# EAGLE schematic PCM5102a (EAGLE 6.5.0)
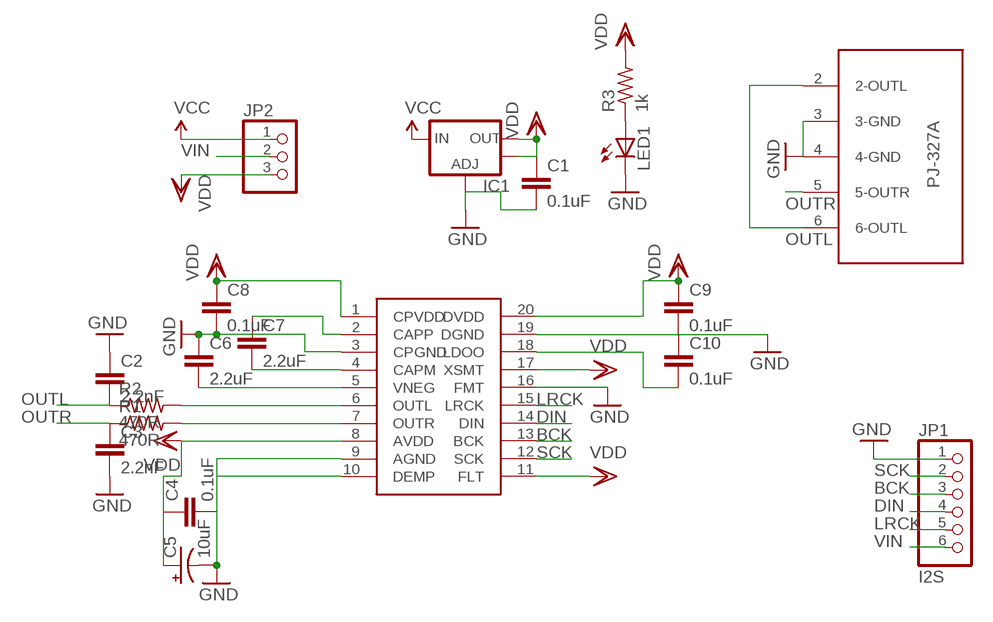
[diagram p0: schematic, sheet 1]

## Parts
C1  0.1uF  2.2UF-CERCAP-10009  [1206]
C2  2.2nF  C5/2.5  [C5B2.5]
C3  2.2nF  C5/2.5  [C5B2.5]
C4  0.1uF  2.2UF-CERCAP-10009  [1206]
C5  10uF  CAP_POLF80  [NIPPON_F80]
C6  2.2uF  2.2UF-CERCAP-10009  [1206]
C7  2.2uF  2.2UF-CERCAP-10009  [1206]
C8  0.1uF  2.2UF-CERCAP-10009  [1206]
C9  0.1uF  2.2UF-CERCAP-10009  [1206]
C10  0.1uF  2.2UF-CERCAP-10009  [1206]
IC1  V_REG_LM1117SOT223  [SOT223]
JP1  I2S  PINHD-1X6/90  [1X06/90]
JP2  PINHD-1X3  [1X03]
LED1  LEDCHIP-LED0805  [CHIP-LED0805]
R1  470R  R-US_0207/10  [0207/10]
R2  470R  R-US_0207/10  [0207/10]
R3  1k  R-US_0207/10  [0207/10]
U$1  PCM5102  [TSSOP20]
U$2  PJ-327A  [PJ-327A]

## Nets
BCK: JP1.3 U$1.13(BCK)
DIN: JP1.4 U$1.14(DIN)
GND: C1.2 C2.1 C3.2 C4.2 C5.- C6.1 C8.2 C9.2 C10.1 IC1.1(ADJ) JP1.1 LED1.C U$1.3(CPGND) U$1.9(AGND) U$1.10(DEMP) U$1.16(FMT) U$1.19(DGND) U$2.3(3-GND) U$2.4(4-GND)
LRCK: JP1.5 U$1.15(LRCK)
N$1: C7.1 U$1.2(CAPP)
N$6: C7.2 U$1.4(CAPM)
N$7: R1.2 U$1.7(OUTR)
N$8: R2.2 U$1.6(OUTL)
N$9: C6.2 U$1.5(VNEG)
N$10: C10.2 U$1.18(LDOO)
N$11: LED1.A R3.1
OUTL: C2.2 R2.1 U$2.2(2-OUTL) U$2.6(6-OUTL)
OUTR: C3.1 R1.1 U$2.5(5-OUTR)
SCK: JP1.2 U$1.12(SCK)
VCC: IC1.3(IN) JP2.1
VDD: C1.1 C4.1 C5.+ C8.1 C9.1 IC1.2(OUT) IC1.4(OUT) JP2.3 R3.2 U$1.1(CPVDD) U$1.8(AVDD) U$1.11(FLT) U$1.17(XSMT) U$1.20(DVDD)
VIN: JP1.6 JP2.2

## Library data of the parts
C1 C4 C8-C10 = SparkFun-Capacitors:2.2UF-CER: 2.2uF Ceramic SMT CAP-07888- 10V, 20% (0603) CAP-10009- 50V, 10% (1206); PROD_ID: CAP-10009; VALUE: 2.2uF
C2 C3 = capacitor-wima:C: CAPACITOR naming: grid - package width
C5 = SparkFun-Capacitors:CAP_POL: Capacitor Polarized These are standard SMD and PTH capacitors. Normally 10uF, 47uF, and 100uF in electrolytic and tantalum varieties. Always verify the external diameter of the through hole cap, it varies with capacity, voltage, and manufacturer. The EIA devices should be standard.
C6 C7 = SparkFun-Capacitors:2.2UF-CER: 2.2uF Ceramic SMT CAP-07888- 10V, 20% (0603) CAP-10009- 50V, 10% (1206); PROD_ID: CAP-10009
IC1 = SparkFun-PowerIC:V_REG_LM1117: Voltage Regulator LM1117 Standard adjustable voltage regulator but in SMD form. Spark Fun Electronics SKU : COM-00595
JP1 = pinhead:PINHD-1X6: PIN HEADER
JP2 = pinhead:PINHD-1X3: PIN HEADER
LED1 = adafruit:LED: LED OSRAM: - CHIPLED LG R971, LG N971, LY N971, LG Q971, LY Q971, LO R971, LY R971 LH N974, LH R974 LS Q976, LO Q976, LY Q976 LO Q996 - Hyper CHIPLED LW Q18S LB Q993, LB Q99A, LB R99A - SideLED LS A670, LO A670, LY A670, LG A670, LP A670 LB A673, LV A673, LT A673, LW A673 LH A674 LY A675 LS A676, LA A676, LO A676, LY A676, LW A676 LS A679, LY A679, LG A679 - Hyper Micro SIDELED® LS Y876, LA Y876, LO Y876, LY Y876 LT Y87S - SmartLED LW L88C, LW L88S LB L89C, LB L89S, LG L890 LS L89K, LO L89K, LY L89K LS L896, LA L896, LO L896, LY L896 - TOPLED LS T670, LO T670, LY T670, LG T670, LP T670 LSG T670, LSP T670, LSY T670, LOP T670, LYG T670 LG T671, LOG T671, LSG T671 LB T673, LV T673, LT T673, LW T673 LH T674 LS T676, LA T676, LO T676, LY T676, LB T676, LH T676, LSB T676, LW T676 LB T67C, LV T67C, LT T67C, LS T67K, LO T67K, LY T67K, LW E67C LS E67B, LA E67B, LO E67B, LY E67B, LB E67C, LV E67C, LT E67C LW T67C LS T679, LY T679, LG T679 LS T770, LO T770, LY T770, LG T770, LP T770 LB T773, LV T773, LT T773, LW T773 LH T774 LS E675, LA E675, LY E675, LS T675 LS T776, LA T776, LO T776, LY T776, LB T776 LHGB T686 LT T68C, LB T68C - Hyper Mini TOPLED® LB M676 - Mini TOPLED Santana® LG M470 LS M47K, LO M47K, LY M47K Source: http://www.osram.convergy.de/
R1-R3 = adafruit:R-US_: RESISTOR, American symbol
U$1 = adafruit:PCM5102
U$2 = PJ-327A:PJ-327A